# Altium schematic sheet GL850G_SSOP28.SchDoc: GL850G SSO28
size A4; Author: Pavel Nadein; DrawnBy: Pavel Nadein; DocumentName: GL850G SSO28
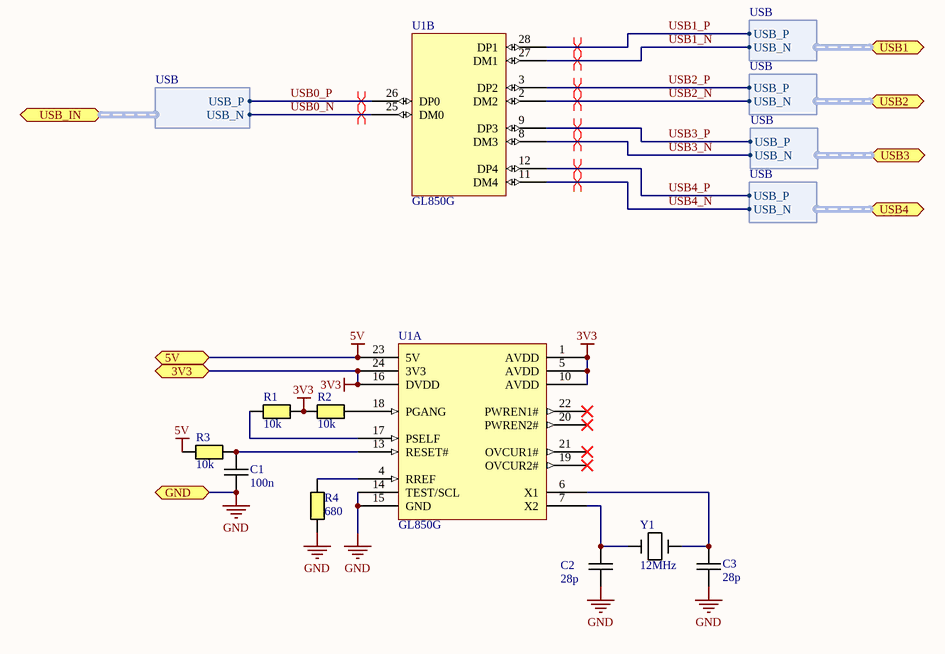
[diagram p0: GL850G_SSOP28.SchDoc]

## Parts
C1  100n  [CAPC0603(1608)55_N]
C2  28p  [CAPC0603(1608)55_N]
C3  28p  [CAPC0603(1608)55_N]
R1  10k  [RESC0603(1608)_N]
R2  10k  [RESC0603(1608)_N]
R3  10k  [RESC0603(1608)_N]
R4  680  [RESC0603(1608)_N]
U1  GL850G  [SSOP28]  (parts A,B of 2)
Y1  12MHz  [HC49 Crystal]

## Ports
3V3, 5V, GND, USB1 (harness USB), USB2 (harness USB), USB3 (harness USB), USB4 (harness USB), USB_IN (harness USB)

## Harnesses
USB: USB_P, USB_N

## Nets
3V3: R1.2 R2.1 U1.1(AVDD) U1.5(AVDD) U1.10(AVDD) U1.16(DVDD) U1.24(3V3) ; port 3V3
5V: R3.1 U1.23(5V) ; port 5V
GND: C1.1 C2.1 C3.2 R4.1 U1.14(TEST/SCL) U1.15(GND) Y1.2 Y1.4 ; port GND
USB0_N: U1.25(DM0) ; port USB_IN.USB_N
USB0_P: U1.26(DP0) ; port USB_IN.USB_P
USB1_N: U1.27(DM1) ; port USB1.USB_N
USB1_P: U1.28(DP1) ; port USB1.USB_P
USB2_N: U1.2(DM2) ; port USB2.USB_N
USB2_P: U1.3(DP2) ; port USB2.USB_P
USB3_N: U1.8(DM3) ; port USB3.USB_N
USB3_P: U1.9(DP3) ; port USB3.USB_P
USB4_N: U1.11(DM4) ; port USB4.USB_N
USB4_P: U1.12(DP4) ; port USB4.USB_P
NetC1_2: C1.2 R3.2 U1.13(RESET#)
NetC2_2: C2.2 U1.7(X2) Y1.1
NetC3_1: C3.1 U1.6(X1) Y1.3
NetR1_1: R1.1 U1.17(PSELF)
NetR2_2: R2.2 U1.18(PGANG)
NetR4_2: R4.2 U1.4(RREF)

Not connected (* = marked no-connect by the designer): U1 19(OVCUR2#)* 20(PWREN2#)* 21(OVCUR1#)* 22(PWREN1#)*

## Layout directives
differential pair: USB0_N, USB0_P, USB1_N, USB1_P, USB2_N, USB2_P, USB3_N, USB3_P, USB4_N, USB4_P

## Library data of the parts
C1-C3 = Capacitor M: Ceramic capacitor Medium density
  C1: Value: 100n
  C2 C3: Value: 28p
R1-R4 = Resistor M: Resistor Medium Density
  R1-R3: Value: 10k
  R4: Value: 680
U1 = GL850G: USB 2.0 Low-Power HUB Controller SSOP28
Y1 = CRYSTAL: Value: 12MHz